# Altium schematic sheet LoRaWAN CO2 measurement Device.SchDoc: NO.1
size A3; Author: Cecily; Revision: 1.0; SheetNumber: 1; SheetTotal: 1; PCBA_CODE: 8262XXXX; Origin: Eagle
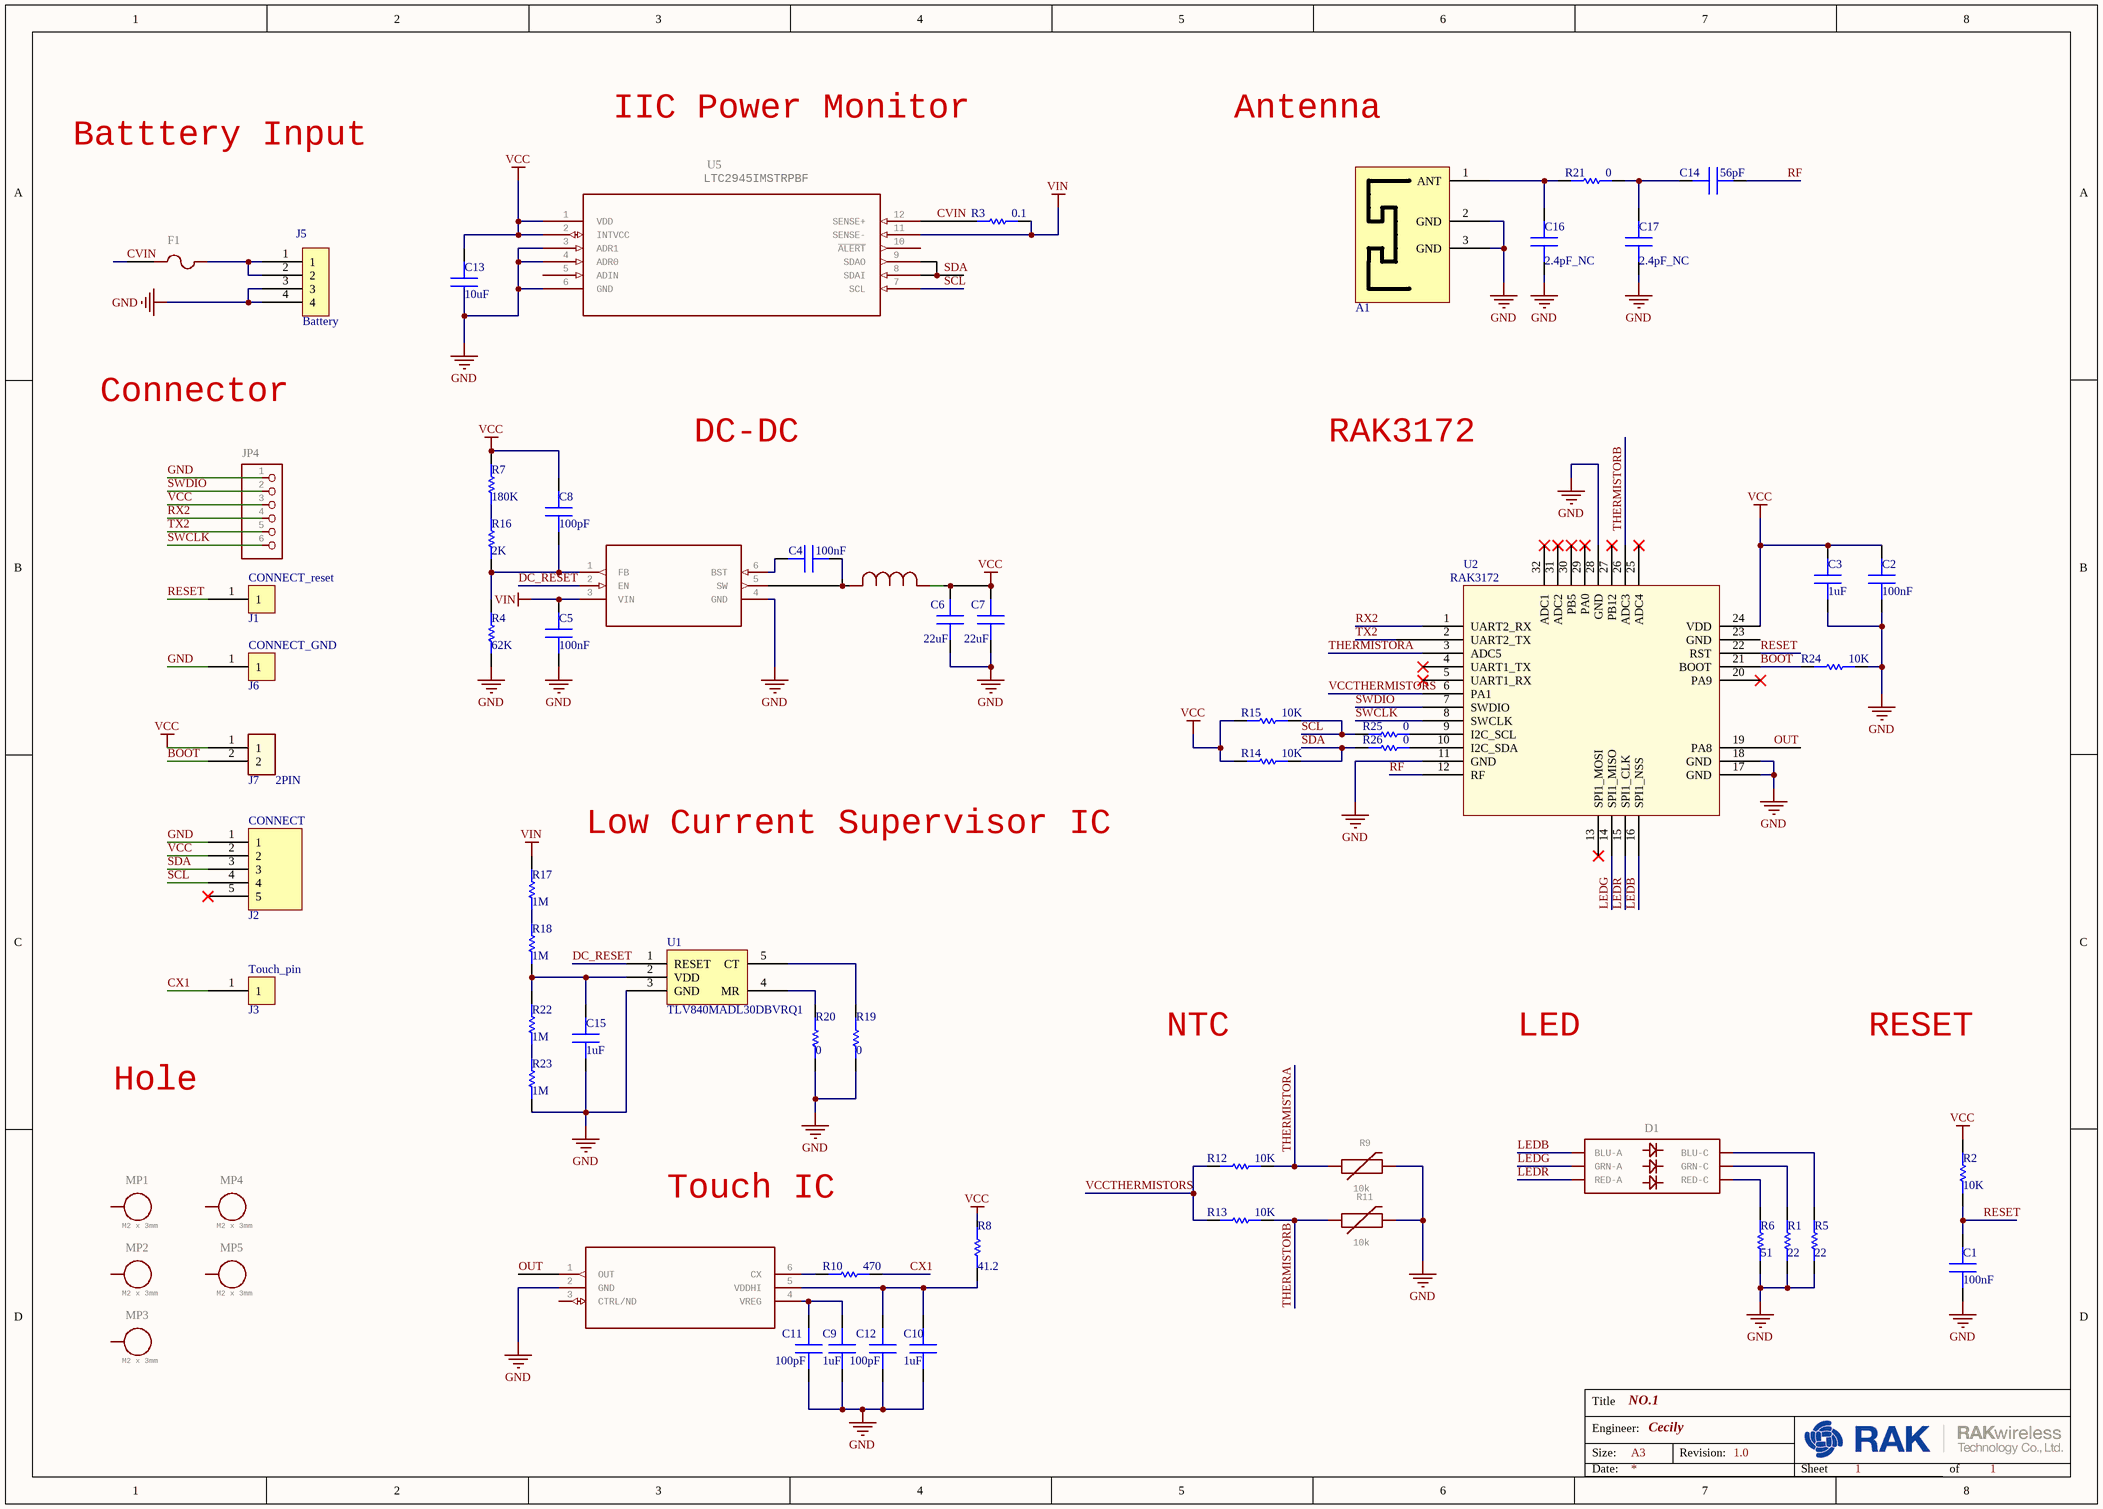
[diagram p0: LoRaWAN CO2 measurement Device.SchDoc]

## Parts
A1  ANT_LORA_Alarm_Button  [ANT_LORA_Alarm_Button]  (value not drawn)
C1  value 100nF  [sc0402]  (hidden comment: CAPACITOR NP)
C2  value 100nF  [sc0402]  (hidden comment: CAPACITOR NP)
C3  value 1uF  [sc0402]  (hidden comment: CAPACITOR NP)
C4  value 100nF  [sc0402]  (hidden comment: CAPACITOR NP)
C5  value 100nF  [sc0402]  (hidden comment: CAPACITOR NP)
C6  value 22uF  [sc0805]  (hidden comment: CAPACITOR NP)
C7  value 22uF  [sc0805]  (hidden comment: CAPACITOR NP)
C8  value 100pF  [sc0402]  (hidden comment: CAPACITOR NP)
C9  value 1uF  [sc0402]  (hidden comment: CAPACITOR NP)
C10  value 1uF  [sc0402]  (hidden comment: CAPACITOR NP)
C11  value 100pF  [sc0402]  (hidden comment: CAPACITOR NP)
C12  value 100pF  [sc0402]  (hidden comment: CAPACITOR NP)
C13  value 10uF  [sc0402]  (hidden comment: CAPACITOR NP)
C14  value 56pF  [sc0402]  (hidden comment: CAPACITOR NP)
C15  value 1uF  [sc0402]  (hidden comment: CAPACITOR NP)
C16  value 2.4pF_NC  [sc0402]  (hidden comment: CAPACITOR NP)
C17  value 2.4pF_NC  [sc0402]  (hidden comment: CAPACITOR NP)
CONNECT  J2  [circle1*5_0.7_1.106]
CONNECT_GND  J6  [circle1*1_1.016_1.788]
CONNECT_reset  J1  [circle1*1_1.016_1.788]
D1  LED-RGBBRG  [LED-TRICOLOR-5050]  (value not drawn)
F1  0031.7701.11  [FUSE_0031.7701.11_SCH]  (value not drawn)
J5  Battery  [Battery_Con]
J7  value 2PIN  [SIP-2P]  (hidden comment: CONN-2)
JP4  PINHD-1X6CB  [1X06-CLEANBIG]  (value not drawn)
L1  SD14-6R9-R  [IND_CB_SD14]  (value not drawn)
MP1  M2 x 3mm  [WA-SMSI_9774030243]
MP2  M2 x 3mm  [WA-SMSI_9774030243]
MP3  M2 x 3mm  [WA-SMSI_9774030243]
MP4  M2 x 3mm  [WA-SMSI_9774030243]
MP5  M2 x 3mm  [WA-SMSI_9774030243]
R1  value 22  [sr0402]  (hidden comment: RESISTOR)
R2  value 10K  [sr0402]  (hidden comment: RESISTOR)
R3  value 0.1  [sr1210]  (hidden comment: RESISTOR)
R4  value 62K  [sr0402]  (hidden comment: RESISTOR)
R5  value 22  [sr0402]  (hidden comment: RESISTOR)
R6  value 51  [sr0402]  (hidden comment: RESISTOR)
R7  value 180K  [sr0402]  (hidden comment: RESISTOR)
R8  value 41.2  [sr0402]  (hidden comment: RESISTOR)
R9  10k  [AXIAL-0.1]
R10  value 470  [sr0402]  (hidden comment: RESISTOR)
R11  10k  [AXIAL-0.1]
R12  value 10K  [sr0402]  (hidden comment: RESISTOR)
R13  value 10K  [sr0402]  (hidden comment: RESISTOR)
R14  value 10K  [sr0402]  (hidden comment: RESISTOR)
R15  value 10K  [sr0402]  (hidden comment: RESISTOR)
R16  value 2K  [sr0402]  (hidden comment: RESISTOR)
R17  value 1M  [sr0402]  (hidden comment: RESISTOR)
R18  value 1M  [sr0402]  (hidden comment: RESISTOR)
R19  value 0  [sr0402]  (hidden comment: RESISTOR)
R20  value 0  [sr0402]  (hidden comment: RESISTOR)
R21  value 0  [sr0402]  (hidden comment: RESISTOR)
R22  value 1M  [sr0402]  (hidden comment: RESISTOR)
R23  value 1M  [sr0402]  (hidden comment: RESISTOR)
R24  value 10K  [sr0402]  (hidden comment: RESISTOR)
R25  value 0  [sr0402]  (hidden comment: RESISTOR)
R26  value 0  [sr0402]  (hidden comment: RESISTOR)
Touch_pin  J3  [circle1*1_0.7]
U1  TLV840MADL30DBVRQ1  [TLV840_SOT-23-5_L2.9-W1.6-P0.95-LS2.8-BR]
U2  RAK3172  [RAK3172]
U3  AP63200WU-7  [TSOT26_DIO]  (value not drawn)
U4  IQS228B00000000TSR  [TSOT23-6_AZQ]  (value not drawn)
U5  LTC2945IMSTRPBF  [MSOP-12_MS_LIT]

## Nets
GND: A1.2(GND) A1.3(GND) C1.2(NEG) C2.2(NEG) C3.1(POS) C5.2(NEG) C6.1(POS) C7.1(POS) C9.1(POS) C10.1(POS) C11.1(POS) C12.1(POS) C13.1(POS) C15.1(POS) C16.1(POS) C17.1(POS) CONNECT.1 CONNECT_GND.1 J5.3 J5.4 JP4.1 R1.1 R4.1 R5.1 R6.1 R9.P$2 R11.P$2 R19.1 R20.1 R23.1 R24.2 U1.3(GND) U2.11(GND) U2.17(GND) U2.18(GND) U2.28(GND) U3.4(GND) U4.2(GND) U5.3(ADR1) U5.4(ADR0) U5.6(GND)
VCC: C2.1(POS) C3.2(NEG) C6.2(NEG) C7.2(NEG) C8.2(NEG) C13.2(NEG) CONNECT.2 J7.1 JP4.3 L1.1 R2.1 R7.1 R8.2 R14.2 R15.2 U2.24(VDD) U5.1(VDD) U5.2(INTVCC)
VIN: C5.1(POS) R3.1 R17.2 U3.3(VIN) U5.11(SENSE-)
BOOT: J7.2 R24.1 U2.21(BOOT)
CVIN: F1.2 R3.2 U5.12(SENSE+)
CX1: R10.1 Touch_pin.1
DC_RESET: U1.1(RESET) U3.2(EN)
LEDB: D1.6(BLU-A) U2.16(SPI1_NSS)
LEDG: D1.4(GRN-A) U2.14(SPI1_MISO)
LEDR: D1.5(RED-A) U2.15(SPI1_CLK)
OUT: U2.19(PA8) U4.1(OUT)
RESET: C1.1(POS) CONNECT_reset.1 R2.2 U2.22(RST)
RF: C14.2(NEG) U2.12(RF)
RX2: JP4.4 U2.1(UART2_RX)
SCL: CONNECT.4 R15.1 R25.2 U5.7(SCL)
SDA: CONNECT.3 R14.1 R26.2 U5.8(SDAI) U5.9(SDAO)
SWCLK: JP4.6 U2.8(SWCLK)
SWDIO: JP4.2 U2.7(SWDIO)
THERMISTORA: R9.P$1 R12.2 U2.3(ADC5)
THERMISTORB: R11.P$1 R13.2 U2.26(ADC3)
TX2: JP4.5 U2.2(UART2_TX)
VCCTHERMISTORS: R12.1 R13.1 U2.6(PA1)
NetA1_1: A1.1(ANT) C16.2(NEG) R21.2
NetC4_1: C4.1(POS) U3.6(BST)
NetC4_2: C4.2(NEG) L1.2 U3.5(SW)
NetC8_1: C8.1(POS) R4.2 R16.1 U3.1(FB)
NetC9_2: C9.2(NEG) C11.2(NEG) U4.4(VREG)
NetC10_2: C10.2(NEG) C12.2(NEG) R8.1 U4.5(VDDHI)
NetC14_1: C14.1(POS) C17.2(NEG) R21.1
NetC15_2: C15.2(NEG) R18.1 R22.2 U1.2(VDD)
NetD1_1: D1.1(BLU-C) R5.2
NetD1_2: D1.2(RED-C) R6.2
NetD1_3: D1.3(GRN-C) R1.2
NetF1_1: F1.1 J5.1 J5.2
NetR7_2: R7.2 R16.2
NetR10_2: R10.2 U4.6(CX)
NetR17_1: R17.1 R18.2
NetR19_2: R19.2 U1.5(CT)
NetR20_2: R20.2 U1.4(MR)
NetR22_1: R22.1 R23.2
NetR25_1: R25.1 U2.9(I2C_SCL)
NetR26_1: R26.1 U2.10(I2C_SDA)

Not connected (* = marked no-connect by the designer): CONNECT 5*; MP1 1; MP2 1; MP3 1; MP4 1; MP5 1; U2 4(UART1_TX)* 5(UART1_RX)* 13(SPI1_MOSI)* 20(PA9)* 23(GND) 25(ADC4)* 27(PB12)* 29(PA0)* 30(PB5)* 31(ADC2)* 32(ADC1)*; U4 3(CTRL/ND); U5 5(ADIN) 10(~{ALERT})

## Notes on the sheet
- Batttery Input
- IIC Power Monitor
- Antenna
- Connector
- DC-DC
- RAK3172
- Low Current Supervisor IC
- NTC
- LED
- RESET
- Hole
- Touch IC
- Title
- Size:
- Engineer:
- A3
- Revision:
- Date:
- Sheet
- of

## Library data of the parts
C1 C2 C4 C5 = 08070561: Capacitor-10V-100nF-±10%-X5R -0402; MANUFACTURER: YAGEO; Part Number: CC0402KRX5R6BB104; TOLERANCE: ±10%; SYMNAME: CAP; VOLTAGE: 10V; RAK Code: K3CA10402KA402; Classification: SMD Ceramic Capacitor; CODE: 08070561
C3 C9 C10 C15 = 08070612: Capacitor-10V-1uF-±10%-X5R-0402; MANUFACTURER: YAGEO; Part Number: CC0402KRX5R6BB105; TOLERANCE: ±10%; SYMNAME: CAP; VOLTAGE: 10V; RAK Code: KRAKBJ08070612; Classification: SMD Ceramic Capacitor; CODE: 08070612
C6 C7 = 0807B024: Capacitor-25V-22uF-±20%-X5R-0805; MANUFACTURER: MURATA; Part Number: GRM21BR61E226ME44L; TOLERANCE: ±20%; SYMNAME: CAP; VOLTAGE: 25V; RAK Code: KRAKBJ0807B024; Classification: SMD Ceramic Capacitor; CODE: 0807B024
C8 C11 C12 = 08070450: Capacitor-50V-100pF-±5%-NPO-0402; MANUFACTURER: YAGEO; Part Number: CC0402JRNPO9BN101; TOLERANCE: ±5%; SYMNAME: CAP; VOLTAGE: 50V; RAK Code: KRAKBJ08070450; Classification: SMD Ceramic Capacitor; CODE: 08070450
C13 = 0807C004: Capacitor-10V-10uF-±20%-X5R-0402; MANUFACTURER: YAGEO; Part Number: CC0402MRX5R6BB106; TOLERANCE: ±20%; SYMNAME: CAP; VOLTAGE: 10V; RAK Code: KRAKBJ0807C004; Classification: SMD Ceramic Capacitor; CODE: 0807C004
C14 = 0807C002: Capacitor-50V-56pF-±5%-COG-0402; MANUFACTURER: Murata; Part Number: GRM1555C1H560JA01D; TOLERANCE: ±5%; SYMNAME: CAP; VOLTAGE: 50V; RAK Code: K3CA56006JA402; Classification: SMD Ceramic Capacitor; CODE: 0807C002
C16 C17 = 0807A00M: Capacitor-50V-2.4pF-±0.1pF-COG-0402; MANUFACTURER: MuRATA; Part Number: GRM1555C1H2R4BA01D; TOLERANCE: ±0.1pF; SYMNAME: CAP; VOLTAGE: 50V; RAK Code: KRAKBJ0807A00M; Classification: SMD Ceramic Capacitor; CODE: 0807A00M
CONNECT = CONNECT
CONNECT_GND CONNECT_reset Touch_pin = CONNECT_1
D1 = LED-RGBBRG: LED-RGB  6 pin RGB LED (no common connector)     Packages:   PLCC-6  LED-TRICOLOR-5050 - No built-in IC    SparkFun Products:; GateName_1: G$1; SymbolName_1: LED-RGB-INDV; DeviceName: BRG; PROD_ID: DIO-16048; LibraryName: SparkFun-LED; DeviceSetName: LED-RGB
F1 = 0031.7701.11: MFR_NAME: Schurter Inc; GateName_1: A; SymbolName_1: FUSE; LibraryName: fusible; DeviceSetName: 0031.7701.11; COPYRIGHT: Copyright (C) 2024 Ultra Librarian. All rights reserved.; MANUFACTURER_PART_NUMBER: 0031.7701.11
J7 = 14050028: Conn Header-Male Pin-1*2Pos-Straight-PH2.54-Through Hole-Pole3.0mm-Mating6mm-Body2.54mm; Manufacturer: STZ01; Part Number: ST-PH-254-0087; RAK Code: KRAKBJ14050028; Classification: Male and Female Header; Code: 14050028
JP4 = PINHD-1X6CB: PIN HEADER; GateName_1: A; SymbolName_1: PINHD6; DeviceName: CB; LibraryName: holes_no_keep; DeviceSetName: PINHD-1X6
L1 = SD14-6R9-R: MFR_NAME: Eaton / Cooper Bussmann; GateName_1: A; SymbolName_1: IND; LibraryName: inductor_eaton_6.9uh; DeviceSetName: SD14-6R9-R; COPYRIGHT: Copyright (C) 2024 Ultra Librarian. All rights reserved.; MANUFACTURER_PART_NUMBER: SD14-6R9-R
MP1-MP5 = WA-SMSI_9774XXX243_9774030243R: WA-SMSI SMT Steel Spacer, M2 Thread Internal  Applications    Assembling of PCBs to housing and to other PCBs   For Distances from 1 to 8 mm   Fast and precise process   Strong holding forces and torques   Highest process reliability   Instant removable Polyimide Tape   Properties   Material Steel  Surface Tin  Ti M2  Solder Paste Thickness 150 碌m  Tightening Torque (Value) 0.2 N*m   General Information   Operating Temperature -55 up to +150 掳C       Details see: https://www.we-online.com/katalog/en/SMSI_SMT_STEEL_SPACER_M2_THREAD_INTERNAL   Updated by Ella Wu  2020-06-03 2021(C) Wurth Elektronik; GateName_1: G$1; INNER-DIAMETER: 2.8mm; OUTER-DIAMETER: 4.35mm; SymbolName_1: WA-SMSI; DeviceName: _9774030243R; LibraryName: Eagle_WA-SMSI_rev21a; DeviceSetName: WA-SMSI_9774XXX243; DATASHEET-URL: https://www.we-online.com/catalog/datasheet/9774030243R.pdf; INNER-THREAD-LENGTH: -; PART-NUMBER: 9774030243R; PIN-LENGTH: 3mm; THREAD: M2
R1 R5 = 07090803: Resistor-1/16W-22Ω-±5%-0402; MANUFACTURER: YAGEO; Part Number: RC0402JR-0722RL; RAK Code: KRAKBJ07090803; Tolerance: ±5%; Classification: Thick Film Resistor; CODE: 07090803
R2 R12-R15 R24 = 07090867: Resistor-1/16W-10KΩ-±1％-0402; MANUFACTURER: YAGEO; Part Number: RC0402FR-0710KL; RAK Code: K3RS01031FA402; Tolerance: ±1%; Classification: Thick Film Resistor; CODE: 07090867
R3 = 0709C03J: Resistor-1/2W-100mΩ-±1％-1210; MANUFACTURER: PANSONIC; Part Number: ERJ-14BSFR10U; RAK Code: KRAKBJ0709C03J; Tolerance: ±1%; Classification: Thick Film Resistor; CODE: 0709C03J
R4 = 0709B003: Resistor-1/16W-62KΩ-±1%-0402; MANUFACTURER: YAGEO; Part Number: RC0402FR-0762KL; RAK Code: KRAKBJ0709B003; Tolerance: ±1%; Classification: Thick Film Resistor; CODE: 0709B003
R6 = 0709C00E: Resistor-1/16W-51Ω-±5%-0402; MANUFACTURER: YAGEO; Part Number: RC0402JR-0751RL; RAK Code: KRAKBJ0709C00E; Tolerance: ±5%; Classification: Thick Film Resistor; CODE: 0709C00E
R7 = 0709C01F: Resistor-1/16W-180KΩ-±1%-0402; MANUFACTURER: YAGEO; Part Number: RC0402FR-07180KL; Tolerance: ±1%; Classification: Thick Film Resistor; CODE: 0709C01F
R8 = 0709B01P: Resistor-1/16W-41.2Ω-±1%-0402; MANUFACTURER: YAGEO; Part Number: RC0402FR-0741R2L; RAK Code: KRAKBJ0709B01P; Tolerance: ±1%; Classification: Thick Film Resistor; CODE: 0709B01P
R9 R11 = NTC-THERMISTOR-AXIAL-0.1: NTC Thermistor    An NTC thermistor's resistance decreases as temperature rises.   Applications:  Resistance Thermometer - temperature monitoring  Inrush current limiter  Heat source; GateName_1: G$1; SF_ID: SEN-00250; SymbolName_1: NTC-THERMISTOR; DeviceName: -AXIAL-0.1; LibraryName: SparkFun-Resistors; DeviceSetName: NTC-THERMISTOR
R10 = 0709C00L: Resistor-1/16W-470Ω-±1%-0402; MANUFACTURER: YAGEO; Part Number: RC0402FR-07470RL; RAK Code: KRAKBJ0709C00L; Tolerance: ±1%; Classification: Thick Film Resistor; CODE: 0709C00L
R16 = 0709C007: Resistor-1/16W-2KΩ-±1%-0402; MANUFACTURER: YAGEO; Part Number: RC0402FR-072KL; RAK Code: K3RS02021FA402; Tolerance: ±1%; Classification: Thick Film Resistor; CODE: 0709C007
R17 R18 R22 R23 = 0709C00Y: Resistor-1/16W-1MΩ-±1％-0402; MANUFACTURER: YAGEO; Part Number: RC0402FR-071ML; RAK Code: KRAKBJ0709C00Y; Tolerance: ±1%; Classification: Thick Film Resistor; CODE: 0709C00Y
R19-R21 R25 R26 = 07090800: Resistor-0Ω-1A-50mΩMAX-0402; MANUFACTURER: YAGEO; Part Number: RC0402JR-070RL; RAK Code: K3RS00001JA402; Tolerance: < 50mΩ; Classification: Thick Film Resistor; CODE: 07090800
U1 = TLV840
U2 = RAK3172: CODE: 6310C01L
U3 = AP63200WU-7: MFR_NAME: Diodes Inc; GateName_1: A; SymbolName_1: AP63200WU-7; LibraryName: AP63200; DeviceSetName: AP63200WU-7; COPYRIGHT: Copyright (C) 2024 Ultra Librarian. All rights reserved.; MANUFACTURER_PART_NUMBER: AP63200WU-7; TYPE: Power Management
U4 = IQS228B00000000TSR: MFR_NAME: Azoteq; GateName_1: A; SymbolName_1: IQS228B_TS; LibraryName: Azeto; DeviceSetName: IQS228B00000000TSR; COPYRIGHT: Copyright (C) 2024 Ultra Librarian. All rights reserved.; MANUFACTURER_PART_NUMBER: IQS228B00000000TSR; TYPE: Interface
U5 = LTC2945IMSTRPBF: MANUFACTURER_PART_NUMBER: LTC2945IMS#TRPBF; MFR_NAME: Analog Devices Inc; GateName_1: A; SymbolName_1: LTC2945IMSTRPBF; LibraryName: ltc2945; DeviceSetName: LTC2945IMSTRPBF; COPYRIGHT: Copyright (C) 2025 Ultra Librarian. All rights reserved.